# Altium schematic sheet RK3562-DDR-PHY.SchDoc
size 420 x 297 mm; SheetNumber: 5; SheetTotal: 32
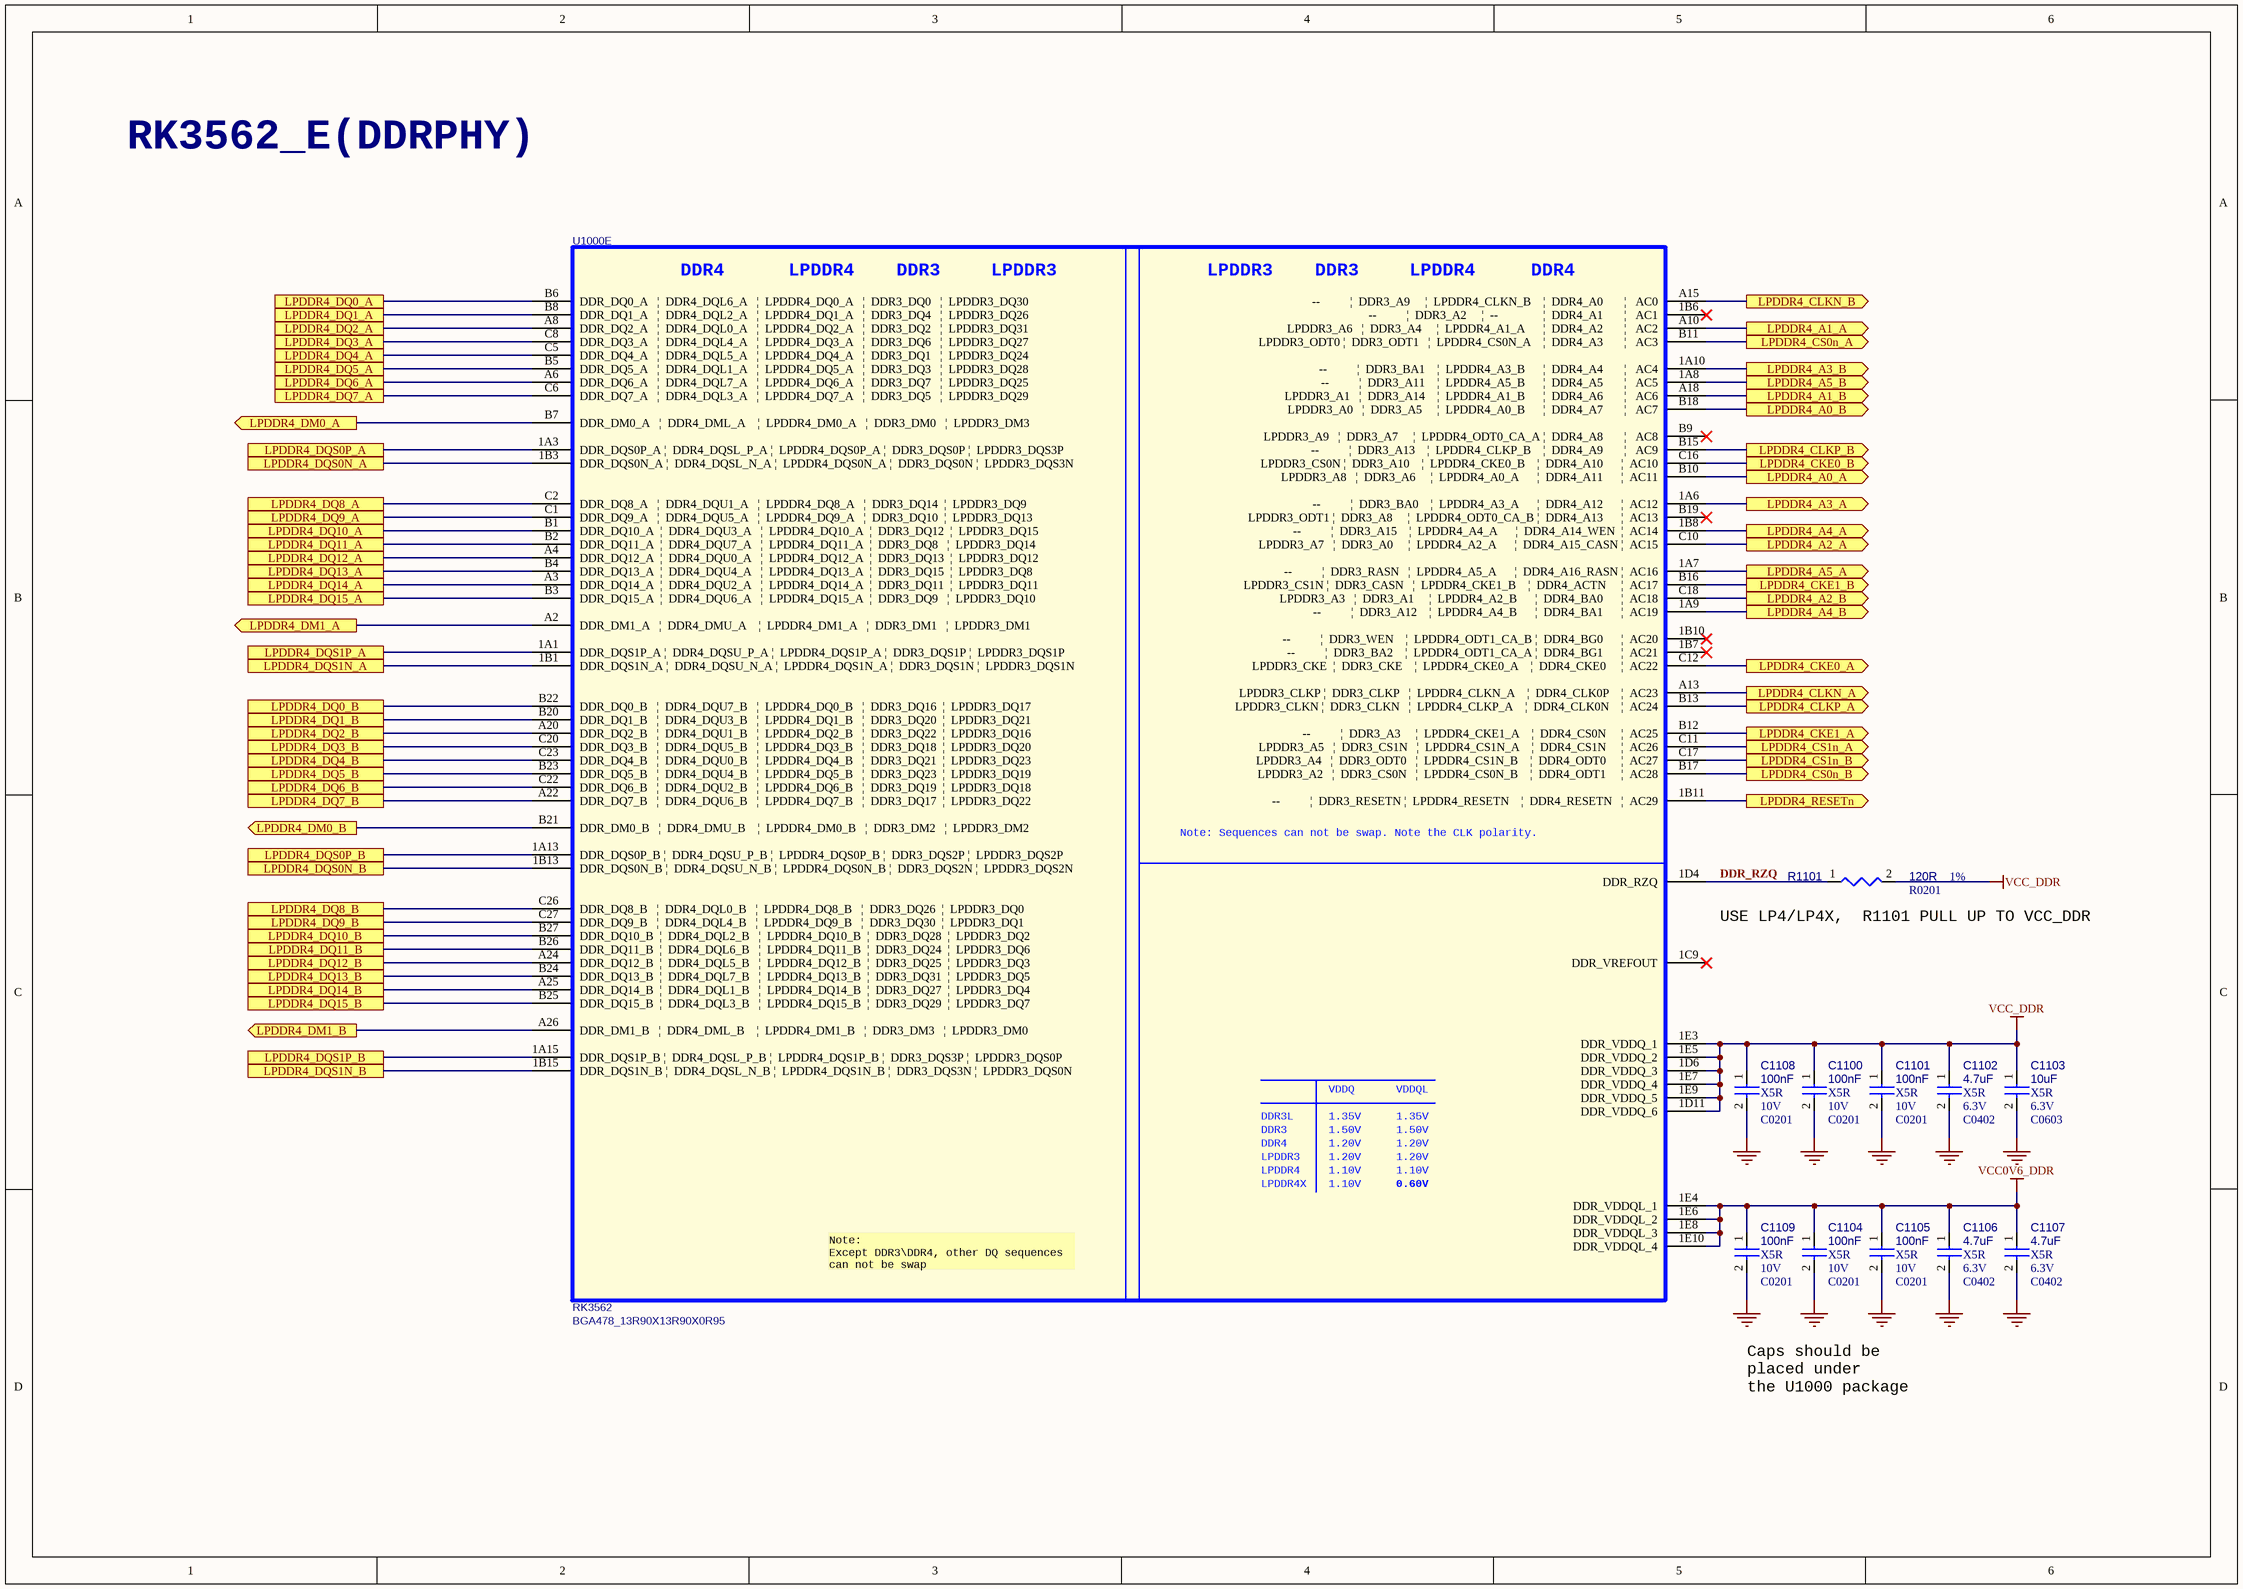
[diagram p0: RK3562-DDR-PHY.SchDoc]

## Parts
C1100  100nF  Dielectric: X5R  Voltage: 10V  [C0201]
C1101  100nF  Dielectric: X5R  Voltage: 10V  [C0201]
C1102  4.7uF  Dielectric: X5R  Voltage: 6.3V  [C0402]
C1103  10uF  Dielectric: X5R  Voltage: 6.3V  [C0603]
C1104  100nF  Dielectric: X5R  Voltage: 10V  [C0201]
C1105  100nF  Dielectric: X5R  Voltage: 10V  [C0201]
C1106  4.7uF  Dielectric: X5R  Voltage: 6.3V  [C0402]
C1107  4.7uF  Dielectric: X5R  Voltage: 6.3V  [C0402]
C1108  100nF  Dielectric: X5R  Voltage: 10V  [C0201]
C1109  100nF  Dielectric: X5R  Voltage: 10V  [C0201]
R1101  120R  Tolerance: 1%  [R0201]
U1000  RK3562  [BGA478_13R90X13R90X0R95]  (part E of 16)

## Ports
LPDDR4_A0_A (out, see CONTROLLER-RK3562[6B], DDR-LPDDR4[1B]), LPDDR4_A0_B (out, see CONTROLLER-RK3562[6C], DDR-LPDDR4[3B]), LPDDR4_A1_A (out, see CONTROLLER-RK3562[6B], DDR-LPDDR4[1B]), LPDDR4_A1_B (out, see CONTROLLER-RK3562[6C], DDR-LPDDR4[3B]), LPDDR4_A2_A (out, see CONTROLLER-RK3562[6B], DDR-LPDDR4[1B]), LPDDR4_A2_B (out, see CONTROLLER-RK3562[6C], DDR-LPDDR4[3B]), LPDDR4_A3_A (out, see CONTROLLER-RK3562[6B], DDR-LPDDR4[1B]), LPDDR4_A3_B (out, see CONTROLLER-RK3562[6C], DDR-LPDDR4[3B]), LPDDR4_A4_A (out, see CONTROLLER-RK3562[6B], DDR-LPDDR4[1B]), LPDDR4_A4_B (out, see CONTROLLER-RK3562[6C], DDR-LPDDR4[3B]), LPDDR4_A5_A (out, see CONTROLLER-RK3562[6B], DDR-LPDDR4[1B]), LPDDR4_A5_B (out, see CONTROLLER-RK3562[6C], DDR-LPDDR4[3B]), LPDDR4_CKE0_A (out, see CONTROLLER-RK3562[6B], DDR-LPDDR4[1B]), LPDDR4_CKE0_B (out, see CONTROLLER-RK3562[6C], DDR-LPDDR4[3B]), LPDDR4_CKE1_A (out, see CONTROLLER-RK3562[6B], DDR-LPDDR4[1B]), LPDDR4_CKE1_B (out, see CONTROLLER-RK3562[6C], DDR-LPDDR4[3B]), LPDDR4_CLKN_A (out, see CONTROLLER-RK3562[6B], DDR-LPDDR4[1B]), LPDDR4_CLKN_B (out, see CONTROLLER-RK3562[6C], DDR-LPDDR4[3B]), LPDDR4_CLKP_A (out, see CONTROLLER-RK3562[6B], DDR-LPDDR4[1B]), LPDDR4_CLKP_B (out, see CONTROLLER-RK3562[6C], DDR-LPDDR4[3B]), LPDDR4_CS0n_A (out, see CONTROLLER-RK3562[6B], DDR-LPDDR4[1B]), LPDDR4_CS0n_B (out, see CONTROLLER-RK3562[6C], DDR-LPDDR4[3B]), LPDDR4_CS1n_A (out, see CONTROLLER-RK3562[6B], DDR-LPDDR4[1B]), LPDDR4_CS1n_B (out, see CONTROLLER-RK3562[6C], DDR-LPDDR4[3B]), LPDDR4_DM0_A (out, see CONTROLLER-RK3562[6B], DDR-LPDDR4[1A]), LPDDR4_DM0_B (out, see CONTROLLER-RK3562[6C], DDR-LPDDR4[3A]), LPDDR4_DM1_A (out, see CONTROLLER-RK3562[6B], DDR-LPDDR4[1B]), LPDDR4_DM1_B (out, see CONTROLLER-RK3562[6C], DDR-LPDDR4[3B]), LPDDR4_DQ0_A (see CONTROLLER-RK3562[6B], DDR-LPDDR4[2A]), LPDDR4_DQ0_B (see CONTROLLER-RK3562[6C], DDR-LPDDR4[3A]), LPDDR4_DQ1_A (see CONTROLLER-RK3562[6B], DDR-LPDDR4[2A]), LPDDR4_DQ1_B (see CONTROLLER-RK3562[6C], DDR-LPDDR4[3A]), LPDDR4_DQ2_A (see CONTROLLER-RK3562[6B], DDR-LPDDR4[2A]), LPDDR4_DQ2_B (see CONTROLLER-RK3562[6C], DDR-LPDDR4[3A]), LPDDR4_DQ3_A (see CONTROLLER-RK3562[6B], DDR-LPDDR4[2A]), LPDDR4_DQ3_B (see CONTROLLER-RK3562[6C], DDR-LPDDR4[3A]), LPDDR4_DQ4_A (see CONTROLLER-RK3562[6B], DDR-LPDDR4[2A]), LPDDR4_DQ4_B (see CONTROLLER-RK3562[6C], DDR-LPDDR4[3A]), LPDDR4_DQ5_A (see CONTROLLER-RK3562[6B], DDR-LPDDR4[2A]), LPDDR4_DQ5_B (see CONTROLLER-RK3562[6C], DDR-LPDDR4[3A]), LPDDR4_DQ6_A (see CONTROLLER-RK3562[6B], DDR-LPDDR4[2A]), LPDDR4_DQ6_B (see CONTROLLER-RK3562[6C], DDR-LPDDR4[3A]), LPDDR4_DQ7_A (see CONTROLLER-RK3562[6B], DDR-LPDDR4[2A]), LPDDR4_DQ7_B (see CONTROLLER-RK3562[6C], DDR-LPDDR4[3A]), LPDDR4_DQ8_A (see CONTROLLER-RK3562[6B], DDR-LPDDR4[2A]), LPDDR4_DQ8_B (see CONTROLLER-RK3562[6C], DDR-LPDDR4[3A]), LPDDR4_DQ9_A (see CONTROLLER-RK3562[6B], DDR-LPDDR4[2A]), LPDDR4_DQ9_B (see CONTROLLER-RK3562[6C], DDR-LPDDR4[3A]), LPDDR4_DQ10_A (see CONTROLLER-RK3562[6B], DDR-LPDDR4[2A]), LPDDR4_DQ10_B (see CONTROLLER-RK3562[6C], DDR-LPDDR4[3A]), LPDDR4_DQ11_A (see CONTROLLER-RK3562[6B], DDR-LPDDR4[2A]), LPDDR4_DQ11_B (see CONTROLLER-RK3562[6C], DDR-LPDDR4[3A]), LPDDR4_DQ12_A (see CONTROLLER-RK3562[6B], DDR-LPDDR4[2A]), LPDDR4_DQ12_B (see CONTROLLER-RK3562[6C], DDR-LPDDR4[3A]), LPDDR4_DQ13_A (see CONTROLLER-RK3562[6B], DDR-LPDDR4[2A]), LPDDR4_DQ13_B (see CONTROLLER-RK3562[6C], DDR-LPDDR4[3A]), LPDDR4_DQ14_A (see CONTROLLER-RK3562[6B], DDR-LPDDR4[2A]), LPDDR4_DQ14_B (see CONTROLLER-RK3562[6C], DDR-LPDDR4[3A]), LPDDR4_DQ15_A (see CONTROLLER-RK3562[6B], DDR-LPDDR4[2A]), LPDDR4_DQ15_B (see CONTROLLER-RK3562[6C], DDR-LPDDR4[3A]), LPDDR4_DQS0N_A (see CONTROLLER-RK3562[6B], DDR-LPDDR4[2A]), LPDDR4_DQS0N_B (see CONTROLLER-RK3562[6C], DDR-LPDDR4[3A]), LPDDR4_DQS0P_A (see CONTROLLER-RK3562[6B], DDR-LPDDR4[2A]), LPDDR4_DQS0P_B (see CONTROLLER-RK3562[6C], DDR-LPDDR4[3A]), LPDDR4_DQS1N_A (see CONTROLLER-RK3562[6B], DDR-LPDDR4[1B]), LPDDR4_DQS1N_B (see CONTROLLER-RK3562[6C], DDR-LPDDR4[3B]), LPDDR4_DQS1P_A (see CONTROLLER-RK3562[6B], DDR-LPDDR4[1A]), LPDDR4_DQS1P_B (see CONTROLLER-RK3562[6C], DDR-LPDDR4[3A]), LPDDR4_RESETn (out, see CONTROLLER-RK3562[6C], DDR-LPDDR4[3C])

## Nets
GND: C1100.2 C1101.2 C1102.2 C1103.2 C1104.2 C1105.2 C1106.2 C1107.2 C1108.2 C1109.2
VCC0V6_DDR: C1104.1 C1105.1 C1106.1 C1107.1 C1109.1 U1000.1E4(DDR_VDDQL_1) U1000.1E6(DDR_VDDQL_2) U1000.1E8(DDR_VDDQL_3) U1000.1E10(DDR_VDDQL_4)
VCC_DDR: C1100.1 C1101.1 C1102.1 C1103.1 C1108.1 R1101.2 U1000.1D6(DDR_VDDQ_3) U1000.1D11(DDR_VDDQ_6) U1000.1E3(DDR_VDDQ_1) U1000.1E5(DDR_VDDQ_2) U1000.1E7(DDR_VDDQ_4) U1000.1E9(DDR_VDDQ_5)
DDR_RZQ: R1101.1 U1000.1D4(DDR_RZQ)
LPDDR4_A0_A: U1000.B10(LPDDR3_A8___|__DDR3_A6_____|__LPDDR4_A0_A______|__DDR4_A11______|__AC11) ; port LPDDR4_A0_A
LPDDR4_A0_B: U1000.B18(LPDDR3_A0___|__DDR3_A5_____|__LPDDR4_A0_B______|__DDR4_A7_______|___AC7) ; port LPDDR4_A0_B
LPDDR4_A1_A: U1000.A10(LPDDR3_A6___|__DDR3_A4_____|__LPDDR4_A1_A______|__DDR4_A2_______|___AC2) ; port LPDDR4_A1_A
LPDDR4_A1_B: U1000.A18(LPDDR3_A1___|__DDR3_A14____|__LPDDR4_A1_B______|__DDR4_A6_______|___AC6) ; port LPDDR4_A1_B
LPDDR4_A2_A: U1000.C10(LPDDR3_A7___|__DDR3_A0_____|__LPDDR4_A2_A______|__DDR4_A15_CASN_|__AC15) ; port LPDDR4_A2_A
LPDDR4_A2_B: U1000.C18(LPDDR3_A3___|__DDR3_A1_____|__LPDDR4_A2_B______|__DDR4_BA0______|__AC18) ; port LPDDR4_A2_B
LPDDR4_A3_A: U1000.1A6(--__________|__DDR3_BA0____|__LPDDR4_A3_A______|__DDR4_A12______|__AC12) ; port LPDDR4_A3_A
LPDDR4_A3_B: U1000.1A10(--__________|__DDR3_BA1____|__LPDDR4_A3_B______|__DDR4_A4_______|___AC4) ; port LPDDR4_A3_B
LPDDR4_A4_A: U1000.1B8(--__________|__DDR3_A15____|__LPDDR4_A4_A______|__DDR4_A14_WEN__|__AC14) ; port LPDDR4_A4_A
LPDDR4_A4_B: U1000.1A9(--__________|__DDR3_A12____|__LPDDR4_A4_B______|__DDR4_BA1______|__AC19) ; port LPDDR4_A4_B
LPDDR4_A5_A: U1000.1A7(--__________|__DDR3_RASN___|__LPDDR4_A5_A______|__DDR4_A16_RASN_|__AC16) ; port LPDDR4_A5_A
LPDDR4_A5_B: U1000.1A8(--__________|__DDR3_A11____|__LPDDR4_A5_B______|__DDR4_A5_______|___AC5) ; port LPDDR4_A5_B
LPDDR4_CKE0_A: U1000.C12(LPDDR3_CKE__|__DDR3_CKE____|__LPDDR4_CKE0_A____|__DDR4_CKE0_____|__AC22) ; port LPDDR4_CKE0_A
LPDDR4_CKE0_B: U1000.C16(LPDDR3_CS0N_|__DDR3_A10____|__LPDDR4_CKE0_B____|__DDR4_A10______|__AC10) ; port LPDDR4_CKE0_B
LPDDR4_CKE1_A: U1000.B12(--__________|__DDR3_A3_____|__LPDDR4_CKE1_A____|__DDR4_CS0N_____|__AC25) ; port LPDDR4_CKE1_A
LPDDR4_CKE1_B: U1000.B16(LPDDR3_CS1N_|__DDR3_CASN___|__LPDDR4_CKE1_B____|__DDR4_ACTN_____|__AC17) ; port LPDDR4_CKE1_B
LPDDR4_CLKN_A: U1000.A13(LPDDR3_CLKP_|__DDR3_CLKP___|__LPDDR4_CLKN_A____|__DDR4_CLK0P____|__AC23) ; port LPDDR4_CLKN_A
LPDDR4_CLKN_B: U1000.A15(--__________|__DDR3_A9_____|__LPDDR4_CLKN_B____|__DDR4_A0_______|___AC0) ; port LPDDR4_CLKN_B
LPDDR4_CLKP_A: U1000.B13(LPDDR3_CLKN_|__DDR3_CLKN___|__LPDDR4_CLKP_A____|__DDR4_CLK0N____|__AC24) ; port LPDDR4_CLKP_A
LPDDR4_CLKP_B: U1000.B15(--__________|__DDR3_A13____|__LPDDR4_CLKP_B____|__DDR4_A9_______|___AC9) ; port LPDDR4_CLKP_B
LPDDR4_CS0n_A: U1000.B11(LPDDR3_ODT0_|__DDR3_ODT1___|__LPDDR4_CS0N_A____|__DDR4_A3_______|___AC3) ; port LPDDR4_CS0n_A
LPDDR4_CS0n_B: U1000.B17(LPDDR3_A2___|__DDR3_CS0N___|__LPDDR4_CS0N_B____|__DDR4_ODT1_____|__AC28) ; port LPDDR4_CS0n_B
LPDDR4_CS1n_A: U1000.C11(LPDDR3_A5___|__DDR3_CS1N___|__LPDDR4_CS1N_A____|__DDR4_CS1N_____|__AC26) ; port LPDDR4_CS1n_A
LPDDR4_CS1n_B: U1000.C17(LPDDR3_A4___|__DDR3_ODT0___|__LPDDR4_CS1N_B____|__DDR4_ODT0_____|__AC27) ; port LPDDR4_CS1n_B
LPDDR4_DM0_A: U1000.B7(DDR_DM0_A___|__DDR4_DML_A____|__LPDDR4_DM0_A___|__DDR3_DM0___|__LPDDR3_DM3) ; port LPDDR4_DM0_A
LPDDR4_DM0_B: U1000.B21(DDR_DM0_B___|__DDR4_DMU_B____|__LPDDR4_DM0_B___|__DDR3_DM2___|__LPDDR3_DM2) ; port LPDDR4_DM0_B
LPDDR4_DM1_A: U1000.A2(DDR_DM1_A___|__DDR4_DMU_A____|__LPDDR4_DM1_A___|__DDR3_DM1___|__LPDDR3_DM1) ; port LPDDR4_DM1_A
LPDDR4_DM1_B: U1000.A26(DDR_DM1_B___|__DDR4_DML_B____|__LPDDR4_DM1_B___|__DDR3_DM3___|__LPDDR3_DM0) ; port LPDDR4_DM1_B
LPDDR4_DQ0_A: U1000.B6(DDR_DQ0_A___|__DDR4_DQL6_A___|__LPDDR4_DQ0_A___|__DDR3_DQ0___|__LPDDR3_DQ30) ; port LPDDR4_DQ0_A
LPDDR4_DQ0_B: U1000.B22(DDR_DQ0_B___|__DDR4_DQU7_B___|__LPDDR4_DQ0_B___|__DDR3_DQ16__|__LPDDR3_DQ17) ; port LPDDR4_DQ0_B
LPDDR4_DQ1_A: U1000.B8(DDR_DQ1_A___|__DDR4_DQL2_A___|__LPDDR4_DQ1_A___|__DDR3_DQ4___|__LPDDR3_DQ26) ; port LPDDR4_DQ1_A
LPDDR4_DQ1_B: U1000.B20(DDR_DQ1_B___|__DDR4_DQU3_B___|__LPDDR4_DQ1_B___|__DDR3_DQ20__|__LPDDR3_DQ21) ; port LPDDR4_DQ1_B
LPDDR4_DQ2_A: U1000.A8(DDR_DQ2_A___|__DDR4_DQL0_A___|__LPDDR4_DQ2_A___|__DDR3_DQ2___|__LPDDR3_DQ31) ; port LPDDR4_DQ2_A
LPDDR4_DQ2_B: U1000.A20(DDR_DQ2_B___|__DDR4_DQU1_B___|__LPDDR4_DQ2_B___|__DDR3_DQ22__|__LPDDR3_DQ16) ; port LPDDR4_DQ2_B
LPDDR4_DQ3_A: U1000.C8(DDR_DQ3_A___|__DDR4_DQL4_A___|__LPDDR4_DQ3_A___|__DDR3_DQ6___|__LPDDR3_DQ27) ; port LPDDR4_DQ3_A
LPDDR4_DQ3_B: U1000.C20(DDR_DQ3_B___|__DDR4_DQU5_B___|__LPDDR4_DQ3_B___|__DDR3_DQ18__|__LPDDR3_DQ20) ; port LPDDR4_DQ3_B
LPDDR4_DQ4_A: U1000.C5(DDR_DQ4_A___|__DDR4_DQL5_A___|__LPDDR4_DQ4_A___|__DDR3_DQ1___|__LPDDR3_DQ24) ; port LPDDR4_DQ4_A
LPDDR4_DQ4_B: U1000.C23(DDR_DQ4_B___|__DDR4_DQU0_B___|__LPDDR4_DQ4_B___|__DDR3_DQ21__|__LPDDR3_DQ23) ; port LPDDR4_DQ4_B
LPDDR4_DQ5_A: U1000.B5(DDR_DQ5_A___|__DDR4_DQL1_A___|__LPDDR4_DQ5_A___|__DDR3_DQ3___|__LPDDR3_DQ28) ; port LPDDR4_DQ5_A
LPDDR4_DQ5_B: U1000.B23(DDR_DQ5_B___|__DDR4_DQU4_B___|__LPDDR4_DQ5_B___|__DDR3_DQ23__|__LPDDR3_DQ19) ; port LPDDR4_DQ5_B
LPDDR4_DQ6_A: U1000.A6(DDR_DQ6_A___|__DDR4_DQL7_A___|__LPDDR4_DQ6_A___|__DDR3_DQ7___|__LPDDR3_DQ25) ; port LPDDR4_DQ6_A
LPDDR4_DQ6_B: U1000.C22(DDR_DQ6_B___|__DDR4_DQU2_B___|__LPDDR4_DQ6_B___|__DDR3_DQ19__|__LPDDR3_DQ18) ; port LPDDR4_DQ6_B
LPDDR4_DQ7_A: U1000.C6(DDR_DQ7_A___|__DDR4_DQL3_A___|__LPDDR4_DQ7_A___|__DDR3_DQ5___|__LPDDR3_DQ29) ; port LPDDR4_DQ7_A
LPDDR4_DQ7_B: U1000.A22(DDR_DQ7_B___|__DDR4_DQU6_B___|__LPDDR4_DQ7_B___|__DDR3_DQ17__|__LPDDR3_DQ22) ; port LPDDR4_DQ7_B
LPDDR4_DQ8_A: U1000.C2(DDR_DQ8_A___|__DDR4_DQU1_A___|__LPDDR4_DQ8_A___|__DDR3_DQ14__|__LPDDR3_DQ9) ; port LPDDR4_DQ8_A
LPDDR4_DQ8_B: U1000.C26(DDR_DQ8_B___|__DDR4_DQL0_B___|__LPDDR4_DQ8_B___|__DDR3_DQ26__|__LPDDR3_DQ0) ; port LPDDR4_DQ8_B
LPDDR4_DQ9_A: U1000.C1(DDR_DQ9_A___|__DDR4_DQU5_A___|__LPDDR4_DQ9_A___|__DDR3_DQ10__|__LPDDR3_DQ13) ; port LPDDR4_DQ9_A
LPDDR4_DQ9_B: U1000.C27(DDR_DQ9_B___|__DDR4_DQL4_B___|__LPDDR4_DQ9_B___|__DDR3_DQ30__|__LPDDR3_DQ1) ; port LPDDR4_DQ9_B
LPDDR4_DQ10_A: U1000.B1(DDR_DQ10_A__|__DDR4_DQU3_A___|__LPDDR4_DQ10_A__|__DDR3_DQ12__|__LPDDR3_DQ15) ; port LPDDR4_DQ10_A
LPDDR4_DQ10_B: U1000.B27(DDR_DQ10_B__|__DDR4_DQL2_B___|__LPDDR4_DQ10_B__|__DDR3_DQ28__|__LPDDR3_DQ2) ; port LPDDR4_DQ10_B
LPDDR4_DQ11_A: U1000.B2(DDR_DQ11_A__|__DDR4_DQU7_A___|__LPDDR4_DQ11_A__|__DDR3_DQ8___|__LPDDR3_DQ14) ; port LPDDR4_DQ11_A
LPDDR4_DQ11_B: U1000.B26(DDR_DQ11_B__|__DDR4_DQL6_B___|__LPDDR4_DQ11_B__|__DDR3_DQ24__|__LPDDR3_DQ6) ; port LPDDR4_DQ11_B
LPDDR4_DQ12_A: U1000.A4(DDR_DQ12_A__|__DDR4_DQU0_A___|__LPDDR4_DQ12_A__|__DDR3_DQ13__|__LPDDR3_DQ12) ; port LPDDR4_DQ12_A
LPDDR4_DQ12_B: U1000.A24(DDR_DQ12_B__|__DDR4_DQL5_B___|__LPDDR4_DQ12_B__|__DDR3_DQ25__|__LPDDR3_DQ3) ; port LPDDR4_DQ12_B
LPDDR4_DQ13_A: U1000.B4(DDR_DQ13_A__|__DDR4_DQU4_A___|__LPDDR4_DQ13_A__|__DDR3_DQ15__|__LPDDR3_DQ8) ; port LPDDR4_DQ13_A
LPDDR4_DQ13_B: U1000.B24(DDR_DQ13_B__|__DDR4_DQL7_B___|__LPDDR4_DQ13_B__|__DDR3_DQ31__|__LPDDR3_DQ5) ; port LPDDR4_DQ13_B
LPDDR4_DQ14_A: U1000.A3(DDR_DQ14_A__|__DDR4_DQU2_A___|__LPDDR4_DQ14_A__|__DDR3_DQ11__|__LPDDR3_DQ11) ; port LPDDR4_DQ14_A
LPDDR4_DQ14_B: U1000.A25(DDR_DQ14_B__|__DDR4_DQL1_B___|__LPDDR4_DQ14_B__|__DDR3_DQ27__|__LPDDR3_DQ4) ; port LPDDR4_DQ14_B
LPDDR4_DQ15_A: U1000.B3(DDR_DQ15_A__|__DDR4_DQU6_A___|__LPDDR4_DQ15_A__|__DDR3_DQ9___|__LPDDR3_DQ10) ; port LPDDR4_DQ15_A
LPDDR4_DQ15_B: U1000.B25(DDR_DQ15_B__|__DDR4_DQL3_B___|__LPDDR4_DQ15_B__|__DDR3_DQ29__|__LPDDR3_DQ7) ; port LPDDR4_DQ15_B
LPDDR4_DQS0N_A: U1000.1B3(DDR_DQS0N_A_|__DDR4_DQSL_N_A_|__LPDDR4_DQS0N_A_|__DDR3_DQS0N_|__LPDDR3_DQS3N) ; port LPDDR4_DQS0N_A
LPDDR4_DQS0N_B: U1000.1B13(DDR_DQS0N_B_|__DDR4_DQSU_N_B_|__LPDDR4_DQS0N_B_|__DDR3_DQS2N_|__LPDDR3_DQS2N) ; port LPDDR4_DQS0N_B
LPDDR4_DQS0P_A: U1000.1A3(DDR_DQS0P_A_|__DDR4_DQSL_P_A_|__LPDDR4_DQS0P_A_|__DDR3_DQS0P_|__LPDDR3_DQS3P) ; port LPDDR4_DQS0P_A
LPDDR4_DQS0P_B: U1000.1A13(DDR_DQS0P_B_|__DDR4_DQSU_P_B_|__LPDDR4_DQS0P_B_|__DDR3_DQS2P_|__LPDDR3_DQS2P) ; port LPDDR4_DQS0P_B
LPDDR4_DQS1N_A: U1000.1B1(DDR_DQS1N_A_|__DDR4_DQSU_N_A_|__LPDDR4_DQS1N_A_|__DDR3_DQS1N_|__LPDDR3_DQS1N) ; port LPDDR4_DQS1N_A
LPDDR4_DQS1N_B: U1000.1B15(DDR_DQS1N_B_|__DDR4_DQSL_N_B_|__LPDDR4_DQS1N_B_|__DDR3_DQS3N_|__LPDDR3_DQS0N) ; port LPDDR4_DQS1N_B
LPDDR4_DQS1P_A: U1000.1A1(DDR_DQS1P_A_|__DDR4_DQSU_P_A_|__LPDDR4_DQS1P_A_|__DDR3_DQS1P_|__LPDDR3_DQS1P) ; port LPDDR4_DQS1P_A
LPDDR4_DQS1P_B: U1000.1A15(DDR_DQS1P_B_|__DDR4_DQSL_P_B_|__LPDDR4_DQS1P_B_|__DDR3_DQS3P_|__LPDDR3_DQS0P) ; port LPDDR4_DQS1P_B
LPDDR4_RESETn: U1000.1B11(--__________|__DDR3_RESETN_|__LPDDR4_RESETN____|__DDR4_RESETN___|__AC29) ; port LPDDR4_RESETn

Not connected (* = marked no-connect by the designer): U1000 1B6(--__________|__DDR3_A2_____|__--_______________|__DDR4_A1_______|___AC1)* 1B7(--__________|__DDR3_BA2____|__LPDDR4_ODT1_CA_A_|__DDR4_BG1______|__AC21)* 1B10(--__________|__DDR3_WEN____|__LPDDR4_ODT1_CA_B_|__DDR4_BG0______|__AC20)* 1C9(DDR_VREFOUT)* B9(LPDDR3_A9___|__DDR3_A7_____|__LPDDR4_ODT0_CA_A_|__DDR4_A8_______|___AC8)* B19(LPDDR3_ODT1_|__DDR3_A8_____|__LPDDR4_ODT0_CA_B_|__DDR4_A13______|__AC13)*

## Notes on the sheet
- RK3562_E(DDRPHY)
- (near R1101) USE LP4/LP4X,  R1101 PULL UP TO VCC_DDR
- Caps should be
  placed under
  the U1000 package
- (in symbol SOC_RK3562, part E) DDR4; LPDDR4; DDR3; LPDDR3; Note: Sequences can not be swap. Note the CLK polarity.; VDDQ; VDDQL; DDR3L; 1.35V; 1.50V; 1.20V; 1.10V; LPDDR4X; 0.60V; Note: / Except DDR3\DDR4, other DQ sequences / can not be swap

## Library data of the parts
C1100 = CAP NP: cap,100.00nF,+/-10%,10V,X5R,C0201; Part Reference: C1100; Manufacturer PN: C0603X5R1A104K030BC; Manufacturer: TDK; Tolerance: 10%; Priority: A; PCB Footprint: C0201; Value: 100nF; Created by: JJJ; Part Type: C0201; RK PN: C0603X5R1A104K030BC; ClassName: RK
C1101 = CAP NP: cap,100.00nF,+/-10%,10V,X5R,C0201; Part Reference: C1101; Manufacturer PN: C0603X5R1A104K030BC; Manufacturer: TDK; Tolerance: 10%; Priority: A; PCB Footprint: C0201; Value: 100nF; Created by: JJJ; Part Type: C0201; RK PN: C0603X5R1A104K030BC; ClassName: RK
C1102 = CAP NP: cap,4.70uF,+/-10%,6.3V,X5R,C0402; Part Reference: C1102; Manufacturer: TDK; RK PN: C1005X5R0J475K050BC; Priority: A; Tolerance: 10%; PCB Footprint: C0402; Value: 4.7uF; Part Type: C0402; Manufacturer PN: C1005X5R0J475K050BC; Created by: JJJ; ClassName: RK
C1103 = CAP NP: cap,10.00uF,+/-10%,6.3V,X5R,C0603; Part Reference: C1103; Manufacturer PN: C1608X5R0J106K080AB; Manufacturer: TDK; Tolerance: 10%; Priority: A; PCB Footprint: C0603; Value: 10uF; Created by: JJJ; Part Type: C0603; RK PN: C1608X5R0J106K080AB; ClassName: RK
C1104 = CAP NP: cap,100.00nF,+/-10%,10V,X5R,C0201; Part Reference: C1104; Manufacturer PN: C0603X5R1A104K030BC; Manufacturer: TDK; Tolerance: 10%; Priority: A; PCB Footprint: C0201; Value: 100nF; Created by: JJJ; Part Type: C0201; RK PN: C0603X5R1A104K030BC; ClassName: RK
C1105 = CAP NP: cap,100.00nF,+/-10%,10V,X5R,C0201; Part Reference: C1105; Manufacturer PN: C0603X5R1A104K030BC; Manufacturer: TDK; Tolerance: 10%; Priority: A; PCB Footprint: C0201; Value: 100nF; Created by: JJJ; Part Type: C0201; RK PN: C0603X5R1A104K030BC; ClassName: RK
C1106 = CAP NP: cap,4.70uF,+/-10%,6.3V,X5R,C0402; Part Reference: C1106; Manufacturer: TDK; RK PN: C1005X5R0J475K050BC; Priority: A; Tolerance: 10%; PCB Footprint: C0402; Value: 4.7uF; Part Type: C0402; Manufacturer PN: C1005X5R0J475K050BC; Created by: JJJ; ClassName: RK
C1107 = CAP NP: cap,4.70uF,+/-10%,6.3V,X5R,C0402; Part Reference: C1107; Manufacturer PN: C1005X5R0J475K050BC; Manufacturer: TDK; Tolerance: 10%; Priority: A; PCB Footprint: C0402; Value: 4.7uF; Created by: JJJ; Part Type: C0402; RK PN: C1005X5R0J475K050BC; ClassName: RK
C1108 = CAP NP: cap,100.00nF,+/-10%,10V,X5R,C0201; Part Reference: C1108; Manufacturer: TDK; RK PN: C0603X5R1A104K030BC; Priority: A; Tolerance: 10%; PCB Footprint: C0201; Value: 100nF; Part Type: C0201; Manufacturer PN: C0603X5R1A104K030BC; Created by: JJJ; ClassName: RK
C1109 = CAP NP: cap,100.00nF,+/-10%,10V,X5R,C0201; Part Reference: C1109; Manufacturer: TDK; RK PN: C0603X5R1A104K030BC; Priority: A; Tolerance: 10%; PCB Footprint: C0201; Value: 100nF; Part Type: C0201; Manufacturer PN: C0603X5R1A104K030BC; Created by: JJJ; ClassName: RK
R1101 = RESISTOR: 通用厚膜电阻,120R,+/-1%,R0201,1/20W.; Part Reference: R1101; Manufacturer PN: RC0201FR-07120RL; Manufacturer: YAGEO; Wattage: 1/20W; Priority: A; PCB Footprint: R0201; Value: 120R; Created by: YTL; Part Type: 通用厚膜电阻; RK PN: RC0201FR-07120RL; ClassName: RK
U1000 = SOC_RK3562: ROCKCHIP SOC; Part Reference: U1000; Manufacturer: Rockchip (瑞芯微); SPLIT_INST: TRUE; SWAP_INFO: (S1+S2+S3+S4+S5+S6+S7+S8+S9+S10+S11+S12+S13+S14+S15+S16); RK PN: 906000425; Priority: A; PCB Footprint: BGA478_13R90X13R90X0R95; Value: RK3562; Part Type: SOC; Manufacturer PN: RK3562; Created by: JJJ; ClassName: RK